# EAGLE design SterownikZaworu (EAGLE 7.1.0)
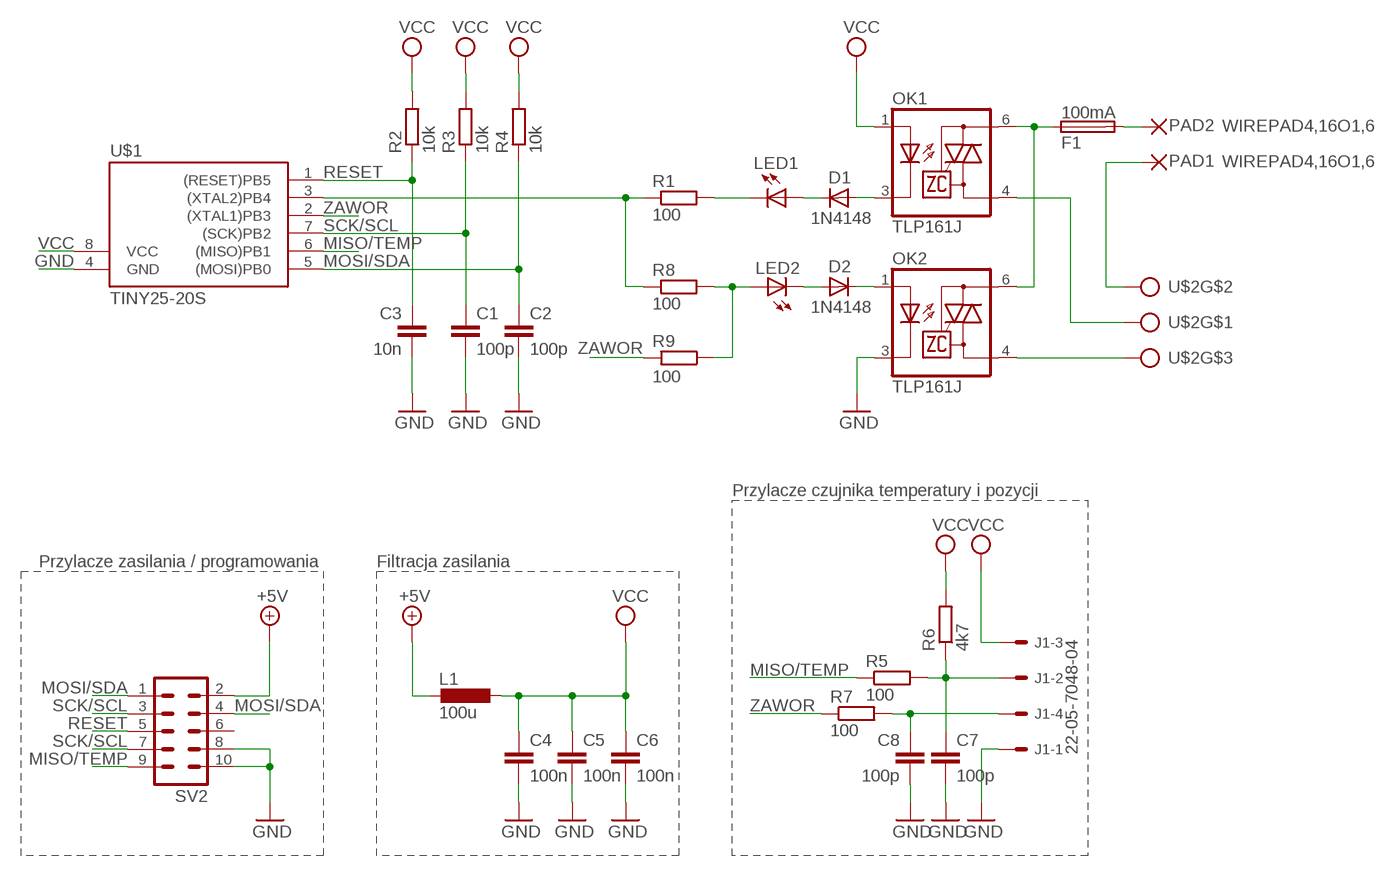
[diagram p0: schematic, sheet 1]

## Parts
C1  100p  C-EUC1206  [C1206]
C2  100p  C-EUC1206  [C1206]
C3  10n  C-EUC1206  [C1206]
C4  100n  C-EUC1206  [C1206]
C5  100n  C-EUC1206  [C1206]
C6  100n  C-EUC1206  [C1206]
C7  100p  C-EUC1206  [C1206]
C8  100p  C-EUC1206  [C1206]
D1  1N4148  DIODE-MINIMELF  [MINIMELF]
D2  1N4148  DIODE-MINIMELF  [MINIMELF]
F1  100mA  F457  [F457]
J1  22-05-7048-04  [7395-04]
L1  100u  L-EUL1210  [R1210]
LED1  LED3MM  [LED3MM]
LED2  LED3MM  [LED3MM]
OK1  TLP161J  [MFP4]
OK2  TLP161J  [MFP4]
PAD1  WIREPAD4,16O1,6  [4,16O1,6]
PAD2  WIREPAD4,16O1,6  [4,16O1,6]
R1  100  R-EU_R1206  [R1206]
R2  10k  R-EU_R1206  [R1206]
R3  10k  R-EU_R1206  [R1206]
R4  10k  R-EU_R1206  [R1206]
R5  100  R-EU_R1206  [R1206]
R6  4k7  R-EU_R1206  [R1206]
R7  100  R-EU_R1206  [R1206]
R8  100  R-EU_R1206  [R1206]
R9  100  R-EU_R1206  [R1206]
SV2  ML10L  [ML10L]
U$1  TINY25-20S  [SOIC8]
U$2  AK3001-3  [AK3001-3]

## Nets
+5V: L1.2 SV2.2
GND: C1.2 C2.2 C3.2 C4.2 C5.2 C6.2 C7.2 C8.2 J1.1 OK2.3(C) SV2.8 SV2.10 U$1.4(GND)
MISO/TEMP: R5.1 SV2.9 U$1.6((MISO)PB1)
MOSI/SDA: C2.1 R4.1 SV2.1 SV2.4 U$1.5((MOSI)PB0)
N$1: PAD1.1(P) U$2.P$3 U$2.P$4
N$2: C7.1 J1.2 R5.2 R6.1
N$3: F1.1 OK1.6(A2) OK2.6(A2)
N$4: D1.A OK1.3(C)
N$5: D1.C LED1.A
N$6: LED1.K(C) R1.2
N$7: R1.1 R8.1 U$1.3((XTAL2)PB4)
N$8: OK1.4(A1) U$2.P$1 U$2.P$2
N$9: OK2.4(A1) U$2.P$5 U$2.P$6
N$10: C8.1 J1.4 R7.2
N$11: F1.2 PAD2.1(P)
N$13: LED2.A R8.2 R9.1
N$14: D2.A LED2.K(C)
N$15: D2.C OK2.1(A)
RESET: C3.1 R2.1 SV2.5 U$1.1((RESET)PB5)
SCK/SCL: C1.1 R3.1 SV2.3 SV2.7 U$1.7((SCK)PB2)
VCC: C4.1 C5.1 C6.1 J1.3 L1.1 OK1.1(A) R2.2 R3.2 R4.2 R6.2 U$1.8(VCC)
ZAWOR: R7.1 R9.2 U$1.2((XTAL1)PB3)
Unconnected: SV2.6

## Notes on the sheet
- Przylacze czujnika temperatury i pozycji
- Przylacze zasilania / programowania | Filtracja zasilania

## Library data of the parts
C1-C8 = rcl:C-EU: CAPACITOR, European symbol
D1 D2 = diode:DIODE-: DIODE
F1 = fuse:F457: FUSE HOLDER CS, Schukat; OC_FARNELL: unknown; OC_NEWARK: unknown
J1 = con-molex:22-?-04: CONNECTOR wire to board 2.54 mm (.1 inch) pitch header; OC_FARNELL: unknown; OC_NEWARK: unknown
L1 = rcl:L-EU: INDUCTOR, European symbol
LED1 LED2 = led:LED: LED OSRAM: - CHIPLED LG R971, LG N971, LY N971, LG Q971, LY Q971, LO R971, LY R971 LH N974, LH R974 LS Q976, LO Q976, LY Q976 LO Q996 - Hyper CHIPLED LW Q18S LB Q993, LB Q99A, LB R99A - SideLED LS A670, LO A670, LY A670, LG A670, LP A670 LB A673, LV A673, LT A673, LW A673 LH A674 LY A675 LS A676, LA A676, LO A676, LY A676, LW A676 LS A679, LY A679, LG A679 - Hyper Micro SIDELED® LS Y876, LA Y876, LO Y876, LY Y876 LT Y87S - SmartLED LW L88C, LW L88S LB L89C, LB L89S, LG L890 LS L89K, LO L89K, LY L89K LS L896, LA L896, LO L896, LY L896 - TOPLED LS T670, LO T670, LY T670, LG T670, LP T670 LSG T670, LSP T670, LSY T670, LOP T670, LYG T670 LG T671, LOG T671, LSG T671 LB T673, LV T673, LT T673, LW T673 LH T674 LS T676, LA T676, LO T676, LY T676, LB T676, LH T676, LSB T676, LW T676 LB T67C, LV T67C, LT T67C, LS T67K, LO T67K, LY T67K, LW E67C LS E67B, LA E67B, LO E67B, LY E67B, LB E67C, LV E67C, LT E67C LW T67C LS T679, LY T679, LG T679 LS T770, LO T770, LY T770, LG T770, LP T770 LB T773, LV T773, LT T773, LW T773 LH T774 LS E675, LA E675, LY E675, LS T675 LS T776, LA T776, LO T776, LY T776, LB T776 LHGB T686 LT T68C, LB T68C - Hyper Mini TOPLED® LB M676 - Mini TOPLED Santana® LG M470 LS M47K, LO M47K, LY M47K Source: http://www.osram.convergy.de LUXEON: - LUMILED® LXK2-PW12-R00, LXK2-PW12-S00, LXK2-PW14-U00, LXK2-PW14-V00 LXK2-PM12-R00, LXK2-PM12-S00, LXK2-PM14-U00 LXK2-PE12-Q00, LXK2-PE12-R00, LXK2-PE12-S00, LXK2-PE14-T00, LXK2-PE14-U00 LXK2-PB12-K00, LXK2-PB12-L00, LXK2-PB12-M00, LXK2-PB14-N00, LXK2-PB14-P00, LXK2-PB14-Q00 LXK2-PR12-L00, LXK2-PR12-M00, LXK2-PR14-Q00, LXK2-PR14-R00 LXK2-PD12-Q00, LXK2-PD12-R00, LXK2-PD12-S00 LXK2-PH12-R00, LXK2-PH12-S00 LXK2-PL12-P00, LXK2-PL12-Q00, LXK2-PL12-R00 Source: www.luxeon.com KINGBRIGHT: KA-3528ASYC Source: www.kingbright.com
OK1 OK2 = RD:TLP161J: Optotriak SMD 2.5kV 600V 10mA MFP4 przełączanie w zerze PBF Source: http://mselektronik.pl/attchmentdownload/download/download/?d=0&file=custom%2Fupload%2FFile-1350758070.pdf
PAD1 PAD2 = wirepad:WIREPAD: Wire PAD connect wire on PCB
R1-R9 = rcl:R-EU_: RESISTOR, European symbol
SV2 = con-harting-ml:ML10: HARTING; OC_FARNELL: unknown; OC_NEWARK: unknown
U$1 = atmel:TINY25: 8-bit Microcontroller with 2KFlash
U$2 = RD:AK3001-3

## Net classes
0 default: clearance 0.355 mm

## Board
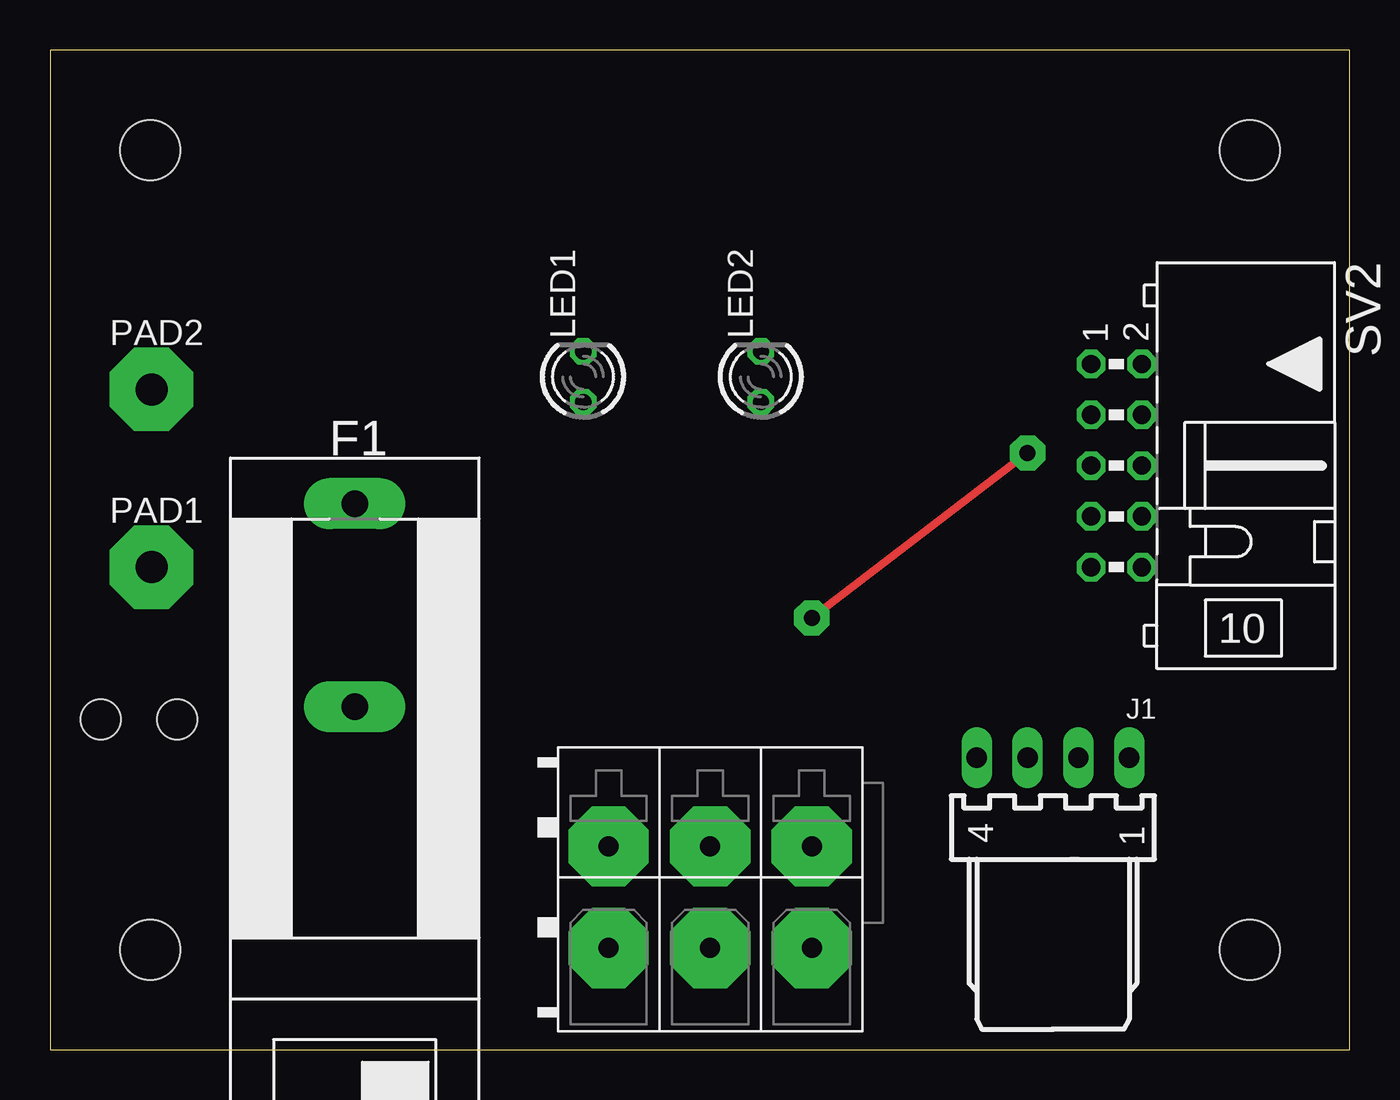
[diagram p1: board, top side]
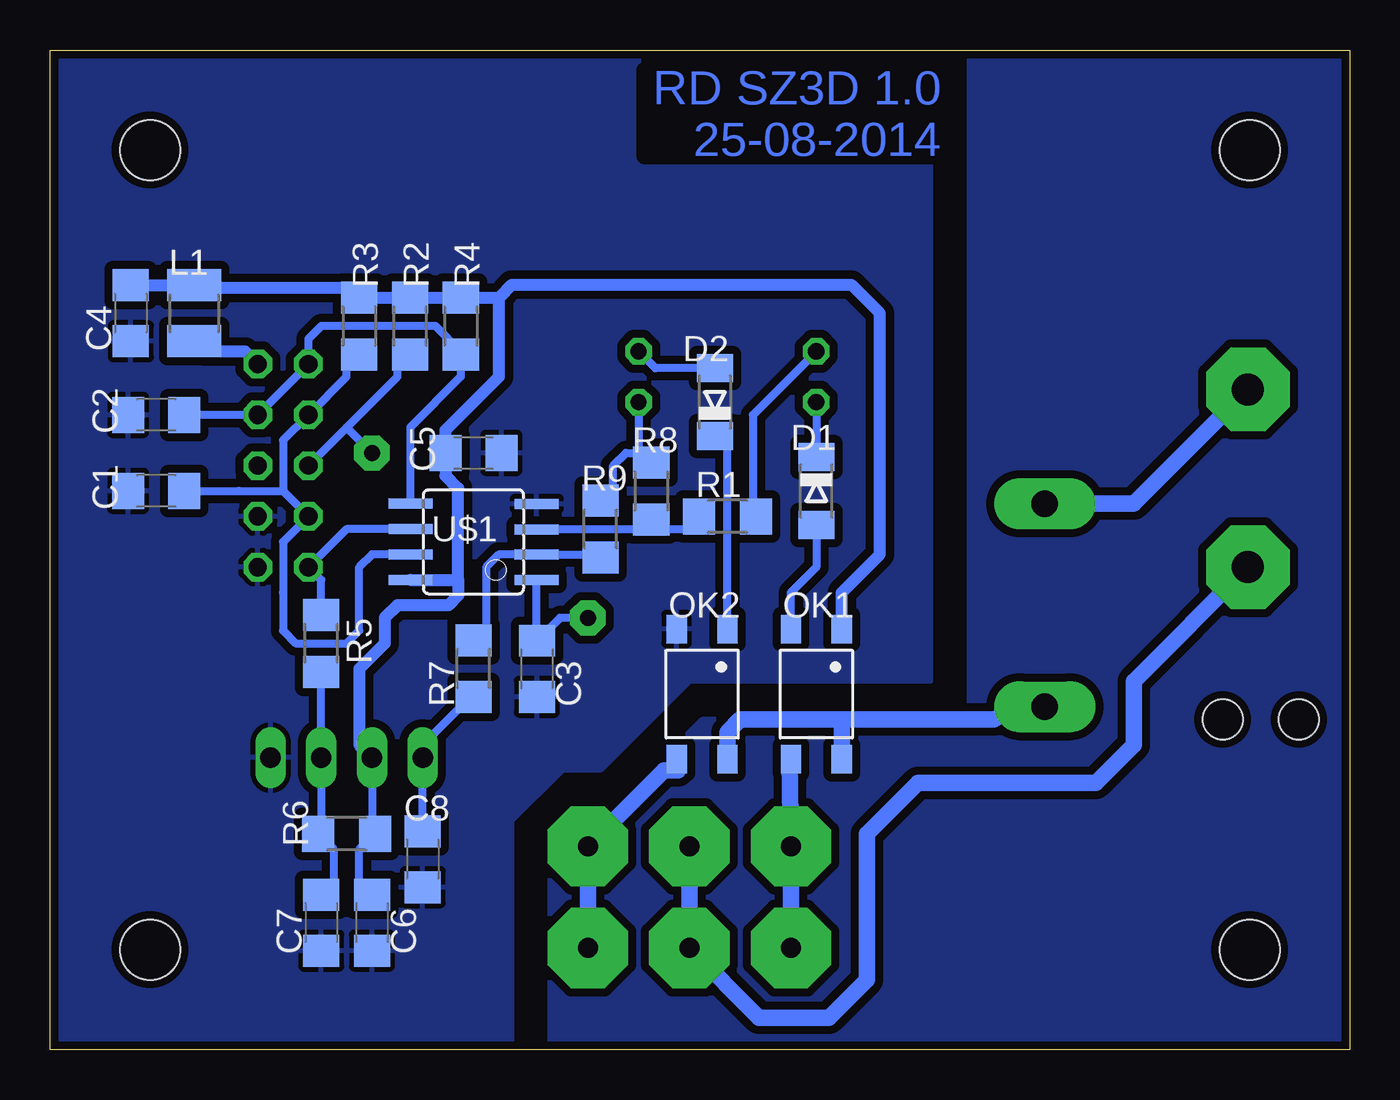
[diagram p2: board, bottom side, seen from below]

Size 65 x 50 mm. Coordinates in mm from the lower left corner, seen from the top.
Outline: 0,0 65,0 65,50 0,50 0,0
Copper layers (1*16): Top 0.035mm / dielectric 1.5mm / Bottom 0.035mm
Design rules "SterownikZaworu *": minimum track width 10mil, minimum drill 24mil, track to track 12mil, track to pad 12mil, pad to pad 12mil, via to via 12mil, smd to smd 8mil, copper to edge 16mil, drill to drill 8mil, minimum pad ring 10mil, minimum via ring 8mil, stop-mask expansion 4mil, vias tented up to drill 0mil, thermal gap 10mil
Holes 3 mm at 5,5 60,5 5,45 60,45
Holes 2 mm at 2.54,16.51 6.35,16.51

### Footprints (pad centres in the part's own frame; a part is rotated, then mirrored left to right if it is on the bottom)
C1206 = smd 1.6 x 1.8: 1 -1.4,0; 2 1.4,0
MINIMELF = smd 1.4 x 1.8: A 1.7,0; C -1.7,0
F457 = drill 1.321 pad 2.54 long: 1 -5.08,0; 2 5.08,0
7395-04 = drill 1.016 long: 1 3.81,0; 2 1.27,0; 3 -1.27,0; 4 -3.81,0
R1210 = smd 1.6 x 2.7: 1 -1.4,0; 2 1.4,0
LED3MM = drill 0.813 octagon: A -1.27,0; K 1.27,0
MFP4 = smd 1.016 x 1.422: 1 -1.27,-3.25; 3 1.27,-3.25; 4 1.27,3.25; 6 -1.27,3.25
4,16O1,6 = drill 1.6 pad 4.166 octagon: 1 0,0
R1206 = smd 1.6 x 1.803: 1 -1.422,0; 2 1.422,0
ML10L = drill 0.914 octagon: 1 -5.08,-1.27; 2 -5.08,1.27; 3 -2.54,-1.27; 4 -2.54,1.27; 5 0,-1.27; 6 0,1.27; 7 2.54,-1.27; 8 2.54,1.27; 9 5.08,-1.27; 10 5.08,1.27
SOIC8 = smd 0.5 x 2.2: 1 -1.905,-3.154; 2 -0.645,-3.154; 3 0.625,-3.154; 4 1.895,-3.154; 5 1.905,3.154; 6 0.635,3.154; 7 -0.635,3.154; 8 -1.905,3.154
AK3001-3 = drill 1 long: P$1 -5.08,2.54; P$2 -5.08,-2.54; P$3 0,2.54; P$4 0,-2.54; P$5 5.08,2.54; P$6 5.08,-2.54

### Placement (x,y rotation side)
C1  59.69,27.94 180 bottom
C2  59.69,31.75 180 bottom
C3  40.64,19.05 270 bottom
C4  60.96,36.83 270 bottom
C5  43.81,29.84 0 bottom
C6  48.9,6.35 270 bottom
C7  51.44,6.35 270 bottom
C8  46.35,9.53 270 bottom
D1  26.67,27.94 270 bottom
D2  31.75,32.38 90 bottom
F1  15.24,22.23 90 top
J1  50.16,14.61 0 top
L1  57.78,36.83 270 bottom
LED1  26.67,33.66 90 top
LED2  35.56,33.66 90 top
OK1  26.67,17.78 180 bottom
OK2  32.38,17.78 180 bottom
PAD1  5.08,24.13 0 top
PAD2  5.08,33.02 0 top
R1  31.11,26.67 0 bottom
R2  46.99,36.2 90 bottom
R3  49.53,36.2 90 bottom
R4  44.45,36.2 90 bottom
R5  51.44,20.32 270 bottom
R6  50.16,10.79 0 bottom
R7  43.81,19.05 270 bottom
R8  34.92,27.94 90 bottom
R9  37.47,26.04 270 bottom
SV2  53.34,29.21 270 top
U$1  43.81,25.4 90 bottom
U$2  33.02,7.62 0 top

### Tracks (layer width: path | path; a pad name or v marks a point on that pad's centre or on a via)
+5V
  Bottom 0.406: 57.28,34.92 L1.2
  Bottom 0.61: SV2.2 55.24,34.92 57.28,34.92
GND
  pour Bottom (isolate 0.406): 66.04,-1.27 66.04,50.8 20.95,50.8 20.95,18.41 33.02,18.41 37.47,13.97 39.37,13.97 41.91,11.43 41.91,-1.27
MISO/TEMP
  Bottom 0.406: U$1.6 50.16,26.04 SV2.9 51.44,23.5 R5.1
MOSI/SDA
  Bottom 0.406: U$1.5 46.97,31.14 44.45,33.66 R4.1 44.45,34.92 45.72,36.2 51.44,36.2 52.07,35.56 SV2.1 SV2.4 C2.1
N$1  (via drill 1 pad 4.01)
  Bottom 0.813: U$2.P$3 U$2.P$4 29.53,1.59 26.04,1.59 24.13,3.49 24.13,10.79 21.59,13.34 12.7,13.34 10.79,15.24 10.79,18.41 PAD1.1
  other vias: 33.02,10.16 33.02,5.08
N$2
  Bottom 0.406: R5.2 J1.2 51.44,10.95 R6.1 50.8,10.01 50.8,8.26 51.3,7.75 C7.1
N$3
  Bottom 0.406: OK1.6 25.4,14.61
  Bottom 0.813: OK2.6 31.11,15.88 30.48,16.51 25.4,16.51 | 25.4,16.51 17.78,16.51 16.51,17.14 F1.1 | 25.4,14.61 25.4,16.51
N$4
  Bottom 0.406: OK1.3 27.94,22.86 26.67,24.13 D1.A
N$5
  Bottom 0.406: LED1.A D1.C
N$6
  Bottom 0.406: LED1.K 29.84,31.75 29.84,26.82 R1.2
N$7
  Bottom 0.406: U$1.3 40.65,26.04 34.92,26.04 | 33.02,27.15 R1.1 33.17,26.04 34.92,26.04 | R8.1 34.92,26.04
N$8  (via drill 1 pad 4.01)
  Bottom 0.406: 28.02,14.45 OK1.4
  Bottom 0.813: U$2.P$2 U$2.P$1 28.02,14.45
  other vias: 27.94,10.16 27.94,5.08
N$9  (via drill 1 pad 4.01)
  Bottom 0.406: U$2.P$5 38.02,10.24
  Bottom 0.813: 38.02,10.24 34.29,13.97 33.58,13.97 OK2.4 | U$2.P$5 U$2.P$6
  other vias: 38.1,10.16 38.1,5.08
N$10
  Bottom 0.406: R7.2 43.97,17.63 46.35,15.24 J1.4 C8.1
N$11
  Bottom 0.813: F1.2 10.79,27.3 PAD2.1
N$12
  pour Bottom (isolate 0.406, no thermals): 19.05,50.16 19.05,16.51 32.38,16.51 40.01,8.89 40.01,0 0,0 0,50.16
N$13
  Bottom 0.406: LED2.A 35.56,29.84 | 35.08,29.84 R8.2 34.92,29.84 35.08,29.84 | R9.1 37.31,27.46 36.83,27.94 36.83,29.21 36.2,29.84 35.56,29.84 | 35.56,29.84 35.08,29.84
N$14
  Bottom 0.406: LED2.K 34.72,34.09 D2.A
N$15
  Bottom 0.406: OK2.1 31.11,30.05 D2.C
RESET  (via drill 0.8)
  Top 0.406: v38.1,21.59 v48.9,29.84
  Bottom 0.406: SV2.5 50.16,31.11 | 50.16,31.11 47.62,33.66 47.62,34.14 R2.1 | v48.9,29.84 50.16,31.11 | U$1.1 40.66,20.45 C3.1 39.5,21.59 v38.1,21.59
SCK/SCL
  Bottom 0.406: 53.34,27.94 SV2.7 53.34,25.4 53.34,22.86 53.34,20.95 52.7,20.32 50.16,20.32 49.53,20.95 49.53,24.13 48.9,24.77 U$1.7 | C1.1 55.56,27.94 53.34,27.94 | 53.34,27.94 53.34,30.48 SV2.3 50.16,33.66 50.16,34.14 R3.1
VCC
  Bottom 0.406: 57.13,38.25 L1.1 | J1.3 48.9,10.95 R6.2 49.53,10.01 49.53,8.26 49.02,7.75 C6.1
  Bottom 0.61: C4.1 L1.1 | 57.13,38.25 57.15,38.1 50.01,38.1 R3.2 R2.2 R4.2 42.55,37.62 | OK1.1 25.4,22.86 23.5,24.77 23.5,36.83 24.92,38.25 41.91,38.25 42.55,37.62 | 42.55,37.62 42.55,33.66 45.22,30.98 C5.1 45.22,28.7 44.58,28.07 44.58,23.5 | 44.58,23.5 44.58,22.73 45.09,22.23 47.62,22.23 48.26,21.59 48.26,20.32 49.53,19.05 49.53,15.24 J1.3 | U$1.8 44.58,23.5
ZAWOR
  Bottom 0.406: R9.2 37.61,24.75 U$1.2 42.55,24.75 43.18,24.13 43.18,21.11 R7.1

### Text on the board
Bottom: RD SZ3D 1.0 / 25-08-2014